# EAGLE schematic AR9721 (EAGLE 9.3.0)
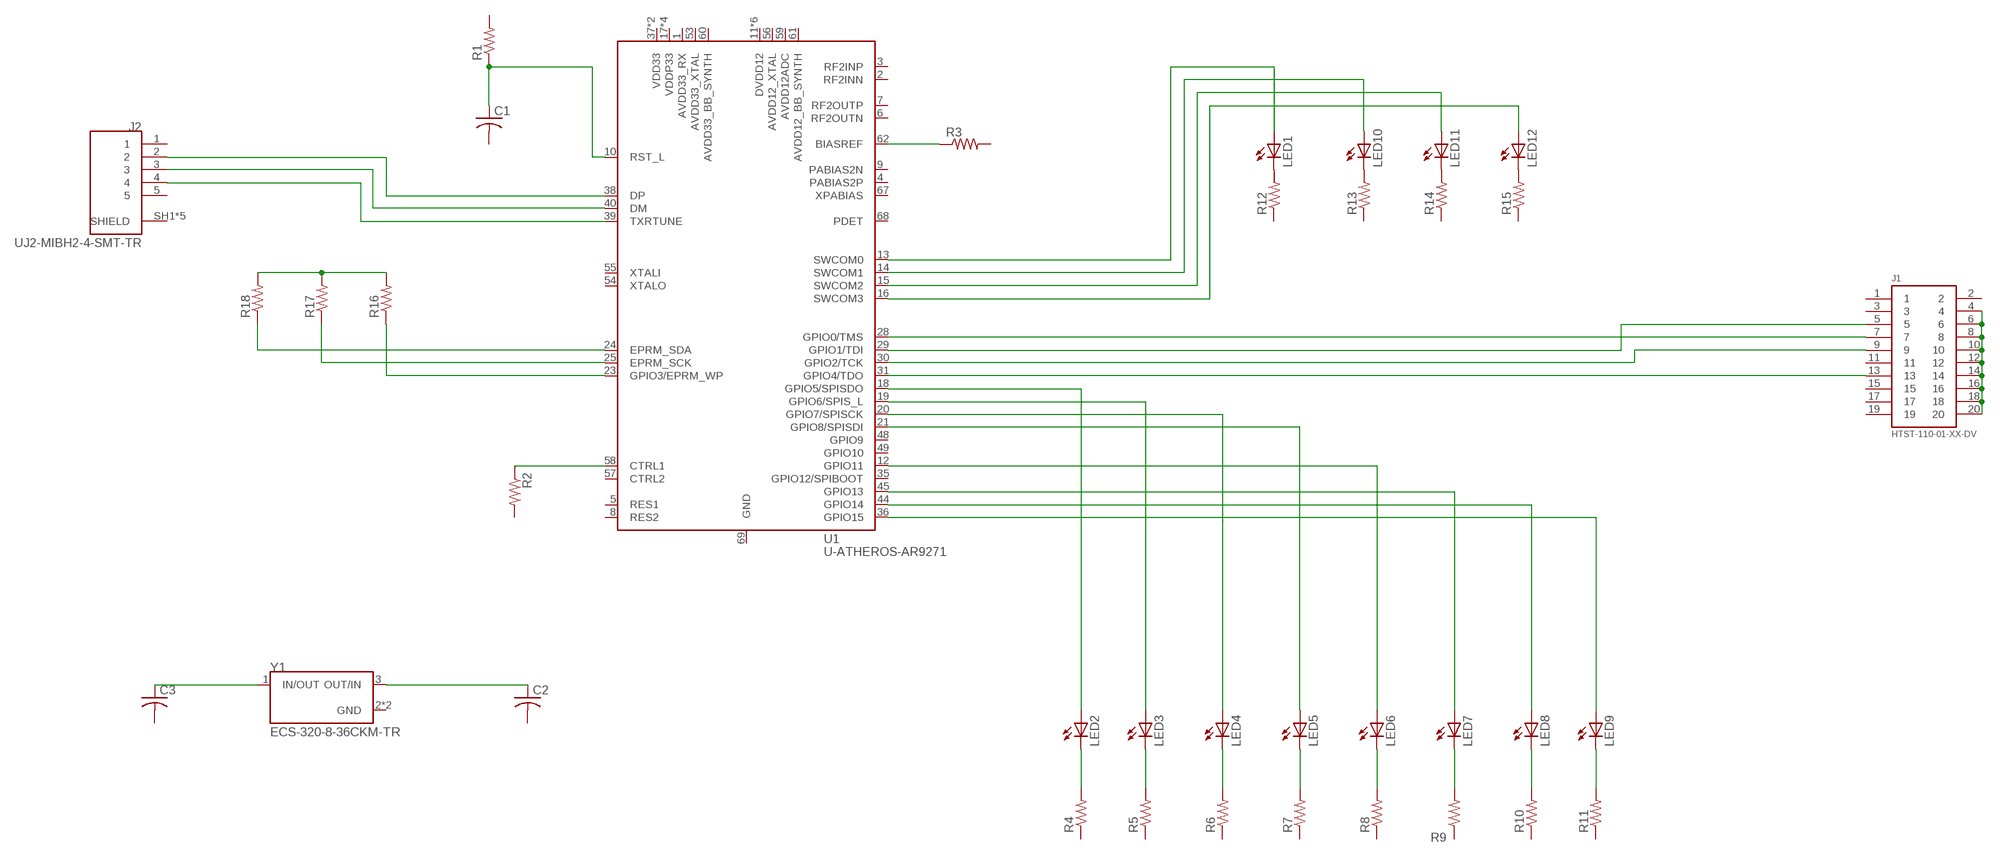
[diagram p0: schematic, sheet 1]

## Parts
C1  C-USC0603  [C0603]
C2  C-USC0603  [C0603]
C3  C-USC0603  [C0603]
J1  HTST-110-01-XX-DV  [HTST-110-01-XX-DV]
J2  UJ2-MIBH2-4-SMT-TR  [CUI_UJ2-MIBH2-4-SMT-TR]
LED1  LEDCHIP-LED0603  [CHIP-LED0603]
LED2  LEDCHIP-LED0603  [CHIP-LED0603]
LED3  LEDCHIP-LED0603  [CHIP-LED0603]
LED4  LEDCHIP-LED0603  [CHIP-LED0603]
LED5  LEDCHIP-LED0603  [CHIP-LED0603]
LED6  LEDCHIP-LED0603  [CHIP-LED0603]
LED7  LEDCHIP-LED0603  [CHIP-LED0603]
LED8  LEDCHIP-LED0603  [CHIP-LED0603]
LED9  LEDCHIP-LED0603  [CHIP-LED0603]
LED10  LEDCHIP-LED0603  [CHIP-LED0603]
LED11  LEDCHIP-LED0603  [CHIP-LED0603]
LED12  LEDCHIP-LED0603  [CHIP-LED0603]
R1  R-US_R0603  [R0603]
R2  R-US_R0603  [R0603]
R3  R-US_R0603  [R0603]
R4  R-US_R0603  [R0603]
R5  R-US_R0603  [R0603]
R6  R-US_R0603  [R0603]
R7  R-US_R0603  [R0603]
R8  R-US_R0603  [R0603]
R9  R-US_R0603  [R0603]
R10  R-US_R0603  [R0603]
R11  R-US_R0603  [R0603]
R12  R-US_R0603  [R0603]
R13  R-US_R0603  [R0603]
R14  R-US_R0603  [R0603]
R15  R-US_R0603  [R0603]
R16  R-US_R0603  [R0603]
R17  R-US_R0603  [R0603]
R18  R-US_R0603  [R0603]
U1  U-ATHEROS-AR9271  [QFN-68]
Y1  ECS-320-8-36CKM-TR  [XTAL_ECS-160-10-36-JGN-TR]

## Nets
N$1: LED2.A U1.18(GPIO5/SPISDO)
N$2: LED3.A U1.19(GPIO6/SPIS_L)
N$3: LED4.A U1.20(GPIO7/SPISCK)
N$4: LED5.A U1.21(GPIO8/SPISDI)
N$5: LED6.A U1.12(GPIO11)
N$6: LED7.A U1.45(GPIO13)
N$7: LED8.A U1.44(GPIO14)
N$8: LED9.A U1.36(GPIO15)
N$9: LED2.C R4.2
N$10: LED3.C R5.2
N$11: LED4.C R6.2
N$12: LED5.C R7.2
N$13: LED6.C R8.2
N$14: LED7.C R9.2
N$15: LED8.C R10.2
N$16: LED9.C R11.2
N$17: LED1.A U1.13(SWCOM0)
N$18: LED10.A U1.14(SWCOM1)
N$19: LED11.A U1.15(SWCOM2)
N$20: LED12.A U1.16(SWCOM3)
N$21: LED1.C R12.2
N$22: LED10.C R13.2
N$23: LED11.C R14.2
N$24: LED12.C R15.2
N$25: R2.1 U1.58(CTRL1)
N$26: R16.2 R17.2 R18.2
N$27: R16.1 U1.23(GPIO3/EPRM_WP)
N$28: R17.1 U1.25(EPRM_SCK)
N$29: R18.1 U1.24(EPRM_SDA)
N$30: R3.1 U1.62(BIASREF)
N$31: C1.1 R1.1 U1.10(RST_L)
N$32: C2.1 Y1.3(OUT/IN)
N$33: C3.1 Y1.1(IN/OUT)
N$34: J2.2 U1.38(DP)
N$35: J2.3 U1.40(DM)
N$36: J2.4 U1.39(TXRTUNE)
N$37: J1.7 U1.28(GPIO0/TMS)
N$38: J1.5 U1.29(GPIO1/TDI)
N$39: J1.9 U1.30(GPIO2/TCK)
N$40: J1.13 U1.31(GPIO4/TDO)
N$41: J1.4 J1.6 J1.8 J1.10 J1.12 J1.14 J1.16 J1.18 J1.20
Unconnected: C1.2 C2.2 C3.2 J1.1 J1.2 J1.3 J1.11 J1.15 J1.17 J1.19 J2.1 J2.5 J2.SH1(SHIELD) J2.SH2(SHIELD) J2.SH3(SHIELD) J2.SH4(SHIELD) J2.SH5(SHIELD) R1.2 R2.2 R3.2 R4.1 R5.1 R6.1 R7.1 R8.1 R9.1 R10.1 R11.1 R12.1 R13.1 R14.1 R15.1 U1.2(RF2INN) U1.3(RF2INP) U1.4(PABIAS2P) U1.5(RES1) U1.6(RF2OUTN) U1.7(RF2OUTP) U1.8(RES2) U1.9(PABIAS2N) U1.35(GPIO12/SPIBOOT) U1.48(GPIO9) U1.49(GPIO10) U1.54(XTALO) U1.55(XTALI) U1.57(CTRL2) U1.67(XPABIAS) U1.68(PDET)

## Power pins joined to a net without a drawn wire
AVDD12_BB_SYNTH: U1.61(AVDD12_BB_SYNTH)
AVDD12_XTAL: U1.56(AVDD12_XTAL)
AVDD12ADC: U1.59(AVDD12ADC)
AVDD33_BB_SYNTH: U1.60(AVDD33_BB_SYNTH)
AVDD33_RX: U1.1(AVDD33_RX)
AVDD33_XTAL: U1.53(AVDD33_XTAL)
DVDD12: U1.11(DVDD12) U1.22(DVDD12) U1.27(DVDD12) U1.42(DVDD12) U1.43(DVDD12) U1.46(DVDD12)
GND: U1.69(GND) Y1.2(GND) Y1.4(GND)
VDD33: U1.37(VDD33) U1.41(VDD33)
VDDP33: U1.17(VDDP33) U1.26(VDDP33) U1.33(VDDP33) U1.47(VDDP33)

## Library data of the parts
C1-C3 = adafruit:C-US: CAPACITOR, American symbol
J1 = HTST-110-01-XX-DV:HTST-110-01-XX-DV: HIGH TEMP TOP SHROUD.
J2 = UJ2-MIBH2-4-SMT-TR:UJ2-MIBH2-4-SMT-TR: Micro B Type 5 Pin Horizontal 30 µin Plating SMT USB Jack 2.0; CUI_PURCHASE_URL: https://www.cui.com/product/interconnect/usb-connectors/micro-b/uj2-mibh2-4-smt?utm_source=snapeda.com&utm_medium=referral&utm_campaign=snapedaBOM; DESCRIPTION: Micro B Type 5 Pin Horizontal 30 µin Plating SMT USB Jack 2.0; DIGI-KEY_PART_NUMBER: 102-4007-1-ND; DIGI-KEY_PURCHASE_URL: https://www.digikey.com/product-detail/en/cui-inc/UJ2-MIBH2-4-SMT-TR/102-4007-1-ND/6187929?utm_source=snapeda&utm_medium=aggregator&utm_campaign=symbol; MF: CUI Inc.; MP: UJ2-MIBH2-4-SMT-TR; PACKAGE: None
LED1-LED12 = adafruit:LED: LED OSRAM: - CHIPLED LG R971, LG N971, LY N971, LG Q971, LY Q971, LO R971, LY R971 LH N974, LH R974 LS Q976, LO Q976, LY Q976 LO Q996 - Hyper CHIPLED LW Q18S LB Q993, LB Q99A, LB R99A - SideLED LS A670, LO A670, LY A670, LG A670, LP A670 LB A673, LV A673, LT A673, LW A673 LH A674 LY A675 LS A676, LA A676, LO A676, LY A676, LW A676 LS A679, LY A679, LG A679 - Hyper Micro SIDELED® LS Y876, LA Y876, LO Y876, LY Y876 LT Y87S - SmartLED LW L88C, LW L88S LB L89C, LB L89S, LG L890 LS L89K, LO L89K, LY L89K LS L896, LA L896, LO L896, LY L896 - TOPLED LS T670, LO T670, LY T670, LG T670, LP T670 LSG T670, LSP T670, LSY T670, LOP T670, LYG T670 LG T671, LOG T671, LSG T671 LB T673, LV T673, LT T673, LW T673 LH T674 LS T676, LA T676, LO T676, LY T676, LB T676, LH T676, LSB T676, LW T676 LB T67C, LV T67C, LT T67C, LS T67K, LO T67K, LY T67K, LW E67C LS E67B, LA E67B, LO E67B, LY E67B, LB E67C, LV E67C, LT E67C LW T67C LS T679, LY T679, LG T679 LS T770, LO T770, LY T770, LG T770, LP T770 LB T773, LV T773, LT T773, LW T773 LH T774 LS E675, LA E675, LY E675, LS T675 LS T776, LA T776, LO T776, LY T776, LB T776 LHGB T686 LT T68C, LB T68C - Hyper Mini TOPLED® LB M676 - Mini TOPLED Santana® LG M470 LS M47K, LO M47K, LY M47K Source: http://www.osram.convergy.de/
R1-R18 = adafruit:R-US_: RESISTOR, American symbol
U1 = U-Atheros-AR9271-WiFi-adapter:U-ATHEROS-AR9271: Atheros WiFi WLAN device
Y1 = ECS-320-8-36CKM-TR:ECS-320-8-36CKM-TR: The minature ECS-160-10-36-JGN-TR is a compact SMD Crystal. The industry standard 2.5 x 2.0 x 0.55 mm ceramic package is ideal for today’s SMD manufacturing environment.; AVAILABILITY: Unavailable; DESCRIPTION: 32.00mhz, 8pf, Ecx-2236, 10/10, -20}c To +70}c, 2.5 x 2.0mm,; MF: ECS Inc.; MP: ECS-320-8-36CKM-TR; PACKAGE: SMD-4 ECS International; PRICE: None